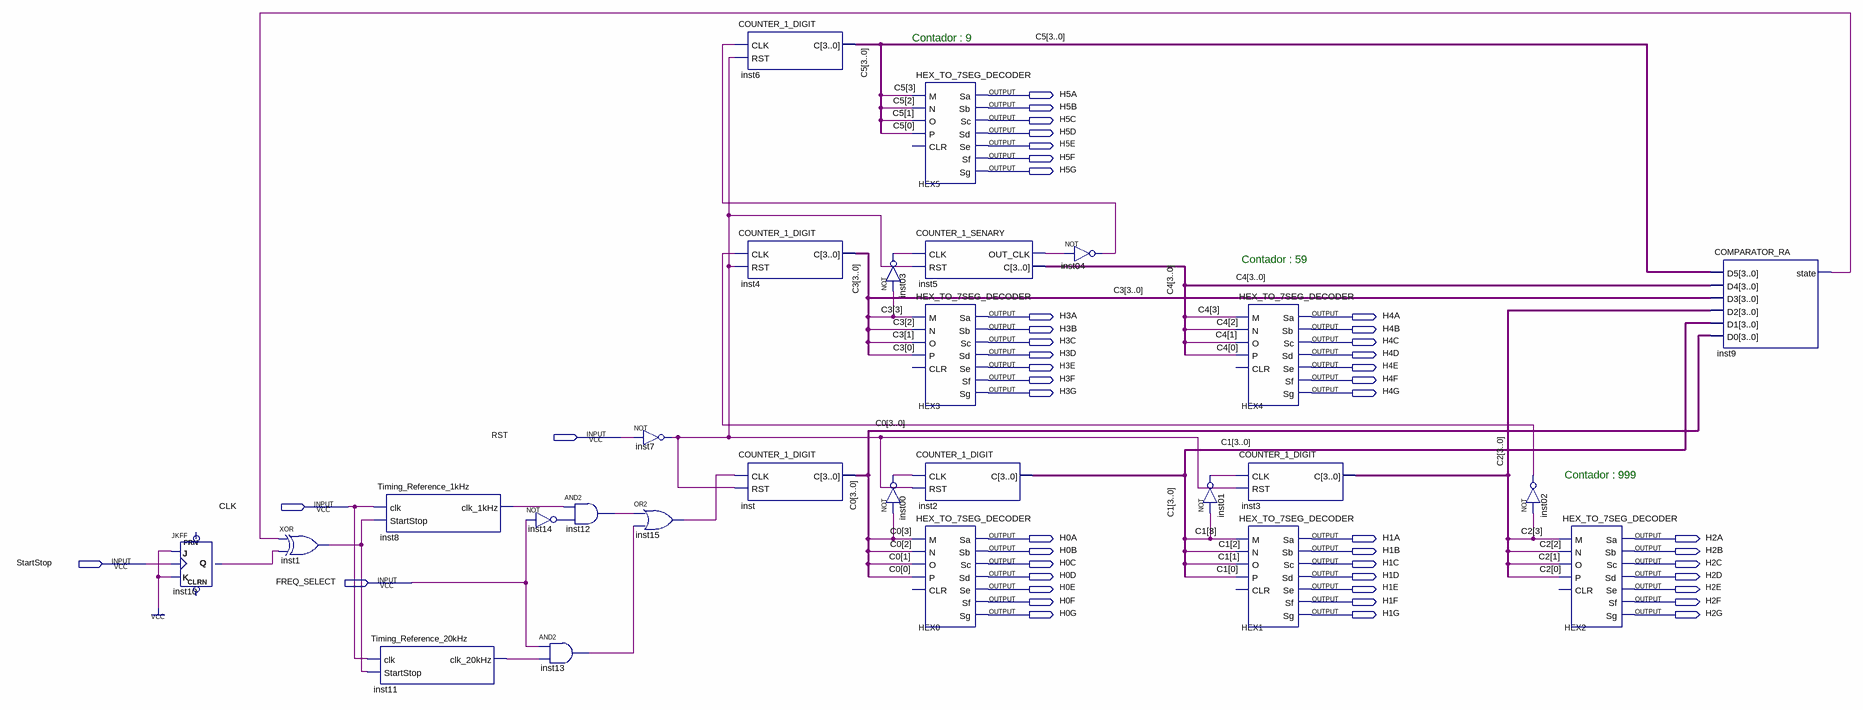
[diagram p0: schematic sheet]
// Quartus schematic main.bdf as structural Verilog: 27 symbols, 46 pins
module main (
  input  RST,
  input  CLK,
  input  StartStop,
  input  FREQ_SELECT,
  output H5A,
  output H5B,
  output H5C,
  output H5D,
  output H5E,
  output H5F,
  output H5G,
  output H3A,
  output H4A,
  output H3B,
  output H4B,
  output H3C,
  output H4C,
  output H3D,
  output H4D,
  output H3E,
  output H4E,
  output H3F,
  output H4F,
  output H3G,
  output H4G,
  output H0A,
  output H1A,
  output H2A,
  output H0B,
  output H1B,
  output H2B,
  output H0C,
  output H1C,
  output H2C,
  output H0D,
  output H1D,
  output H2D,
  output H0E,
  output H1E,
  output H2E,
  output H0F,
  output H1F,
  output H2F,
  output H0G,
  output H1G,
  output H2G
);

  wire inst00_out, inst01_out, inst1_out, inst02_out, inst03_out, inst04_out, inst5_out_clk, inst7_out,
       inst8_clk_1khz, inst9_state, inst10_q, inst11_clk_20khz, inst12_out, inst13_out, inst14_out,
       inst15_out;
  wire [3:0] C0, C1, C2, C3, C4, C5;

  JKFF inst10 (.K(1'b1), .J(1'b1), .CLK(StartStop), .Q(inst10_q));  // open: PRN, CLRN
  xor inst1 (inst1_out, inst9_state, inst10_q);
  Timing_Reference_1kHz inst8 (.clk(CLK), .StartStop(inst1_out), .clk_1kHz(inst8_clk_1khz));
  Timing_Reference_20kHz inst11 (.clk(CLK), .StartStop(inst1_out), .clk_20kHz(inst11_clk_20khz));
  not inst14 (inst14_out, FREQ_SELECT);
  and inst12 (inst12_out, inst8_clk_1khz, inst14_out);
  and inst13 (inst13_out, FREQ_SELECT, inst11_clk_20khz);
  not inst7 (inst7_out, RST);
  or inst15 (inst15_out, inst12_out, inst13_out);
  COUNTER_1_DIGIT inst6 (.CLK(inst04_out), .RST(inst7_out), .C(C5));
  COUNTER_1_DIGIT inst4 (.CLK(inst02_out), .RST(inst7_out), .C(C3));
  COUNTER_1_DIGIT inst (.CLK(inst15_out), .RST(inst7_out), .C(C0));
  not inst03 (inst03_out, C3[3]);
  not inst00 (inst00_out, C0[3]);
  HEX_TO_7SEG_DECODER HEX5 (
    .M(C5[3]), .N(C5[2]), .O(C5[1]), .P(C5[0]), .Sa(H5A), .Sb(H5B), .Sc(H5C), .Sd(H5D), .Se(H5E), .Sf(H5F),
    .Sg(H5G));  // open: CLR
  COUNTER_1_SENARY inst5 (.CLK(inst03_out), .RST(inst7_out), .OUT_CLK(inst5_out_clk), .C(C4));
  HEX_TO_7SEG_DECODER HEX3 (
    .M(C3[3]), .N(C3[2]), .O(C3[1]), .P(C3[0]), .Sa(H3A), .Sb(H3B), .Sc(H3C), .Sd(H3D), .Se(H3E), .Sf(H3F),
    .Sg(H3G));  // open: CLR
  COUNTER_1_DIGIT inst2 (.CLK(inst00_out), .RST(inst7_out), .C(C1));
  HEX_TO_7SEG_DECODER HEX0 (
    .M(C0[3]), .N(C0[2]), .O(C0[1]), .P(C0[0]), .Sa(H0A), .Sb(H0B), .Sc(H0C), .Sd(H0D), .Se(H0E), .Sf(H0F),
    .Sg(H0G));  // open: CLR
  not inst04 (inst04_out, inst5_out_clk);
  HEX_TO_7SEG_DECODER HEX4 (
    .M(C4[3]), .N(C4[2]), .O(C4[1]), .P(C4[0]), .Sa(H4A), .Sb(H4B), .Sc(H4C), .Sd(H4D), .Se(H4E), .Sf(H4F),
    .Sg(H4G));  // open: CLR
  COUNTER_1_DIGIT inst3 (.CLK(inst01_out), .RST(inst7_out), .C(C2));
  not inst01 (inst01_out, C1[3]);
  HEX_TO_7SEG_DECODER HEX1 (
    .M(C1[3]), .N(C1[2]), .O(C1[1]), .P(C1[0]), .Sa(H1A), .Sb(H1B), .Sc(H1C), .Sd(H1D), .Se(H1E), .Sf(H1F),
    .Sg(H1G));  // open: CLR
  not inst02 (inst02_out, C2[3]);
  HEX_TO_7SEG_DECODER HEX2 (
    .M(C2[3]), .N(C2[2]), .O(C2[1]), .P(C2[0]), .Sa(H2A), .Sb(H2B), .Sc(H2C), .Sd(H2D), .Se(H2E), .Sf(H2F),
    .Sg(H2G));  // open: CLR
  COMPARATOR_RA inst9 (.D5(C5), .D4(C4), .D3(C3), .D2(C2), .D1(C1), .D0(C0), .state(inst9_state));

  // Notes on the sheet:
  //   Contador : 9
  //   Contador : 59
  //   Contador : 999
endmodule
